# Altium schematic sheet Sheet.SchDoc
size A3
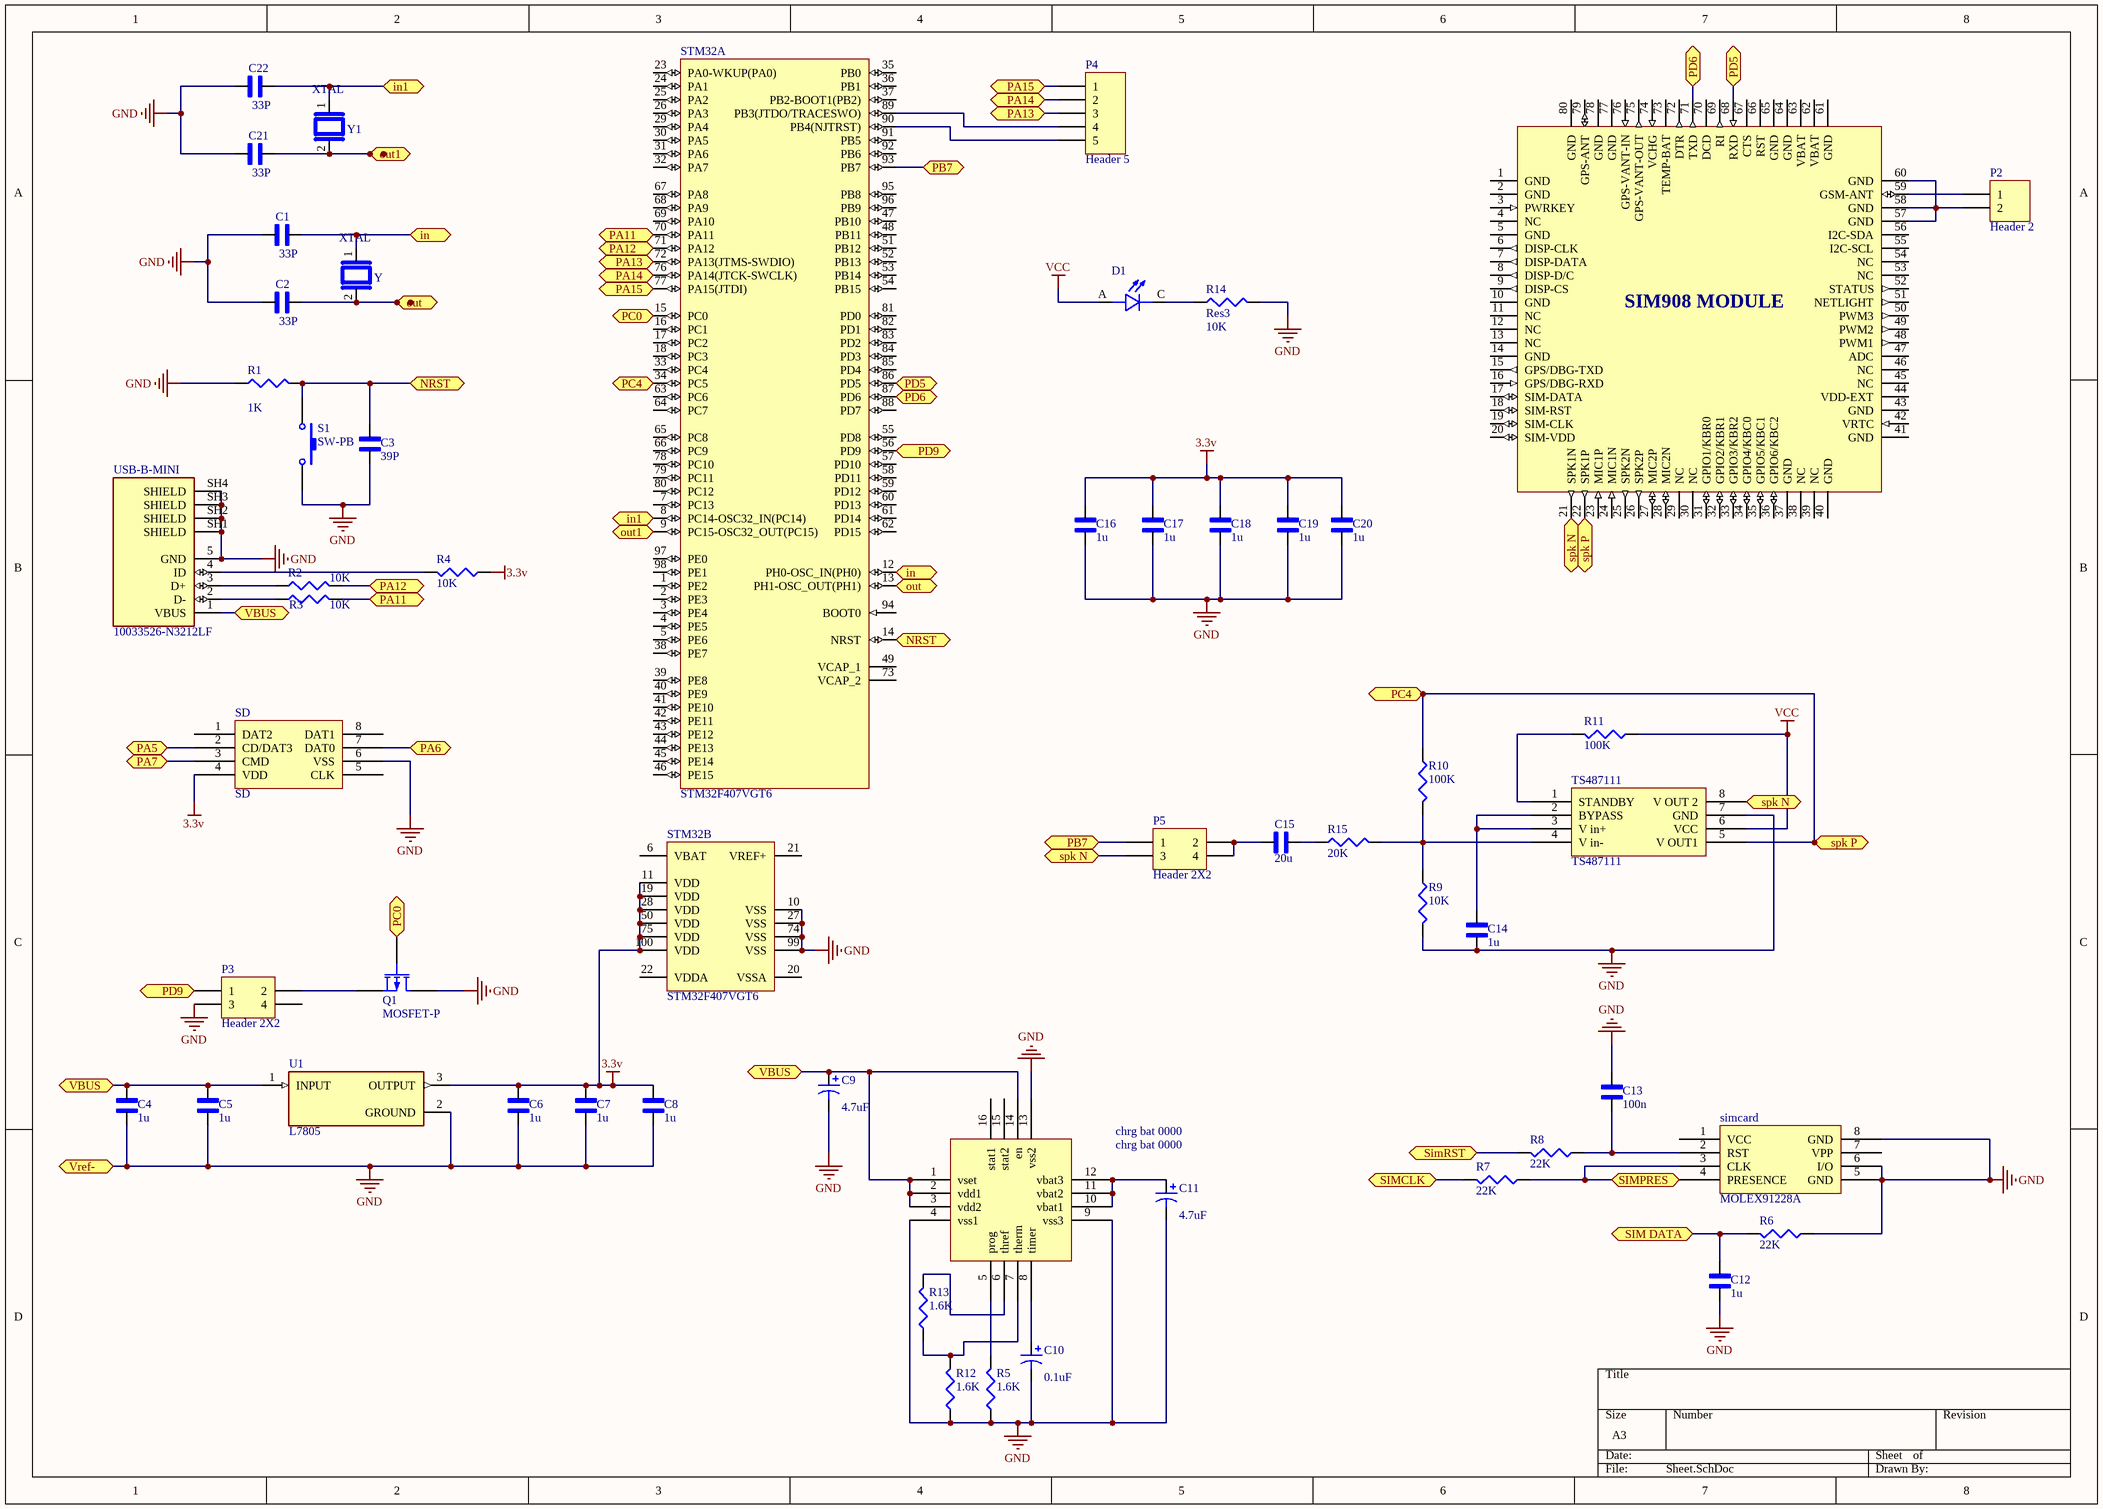
[diagram p0: Sheet.SchDoc]

## Parts
C1  value 33P  [CAP_CGJ3E3C0G2D101J080AA]  (hidden comment: CGJ3E3C0G2D101J080AA)
C2  value 33P  [CAP_CGJ3E3C0G2D101J080AA]  (hidden comment: CGJ3E3C0G2D101J080AA)
C3  value 39P  [CAP_CGJ3E3C0G2D101J080AA]  (hidden comment: CGJ3E3C0G2D101J080AA)
C4  value 1u  [CAP_CGJ3E3C0G2D101J080AA]  (hidden comment: CGJ3E3C0G2D101J080AA)
C5  value 1u  [CAP_CGJ3E3C0G2D101J080AA]  (hidden comment: CGJ3E3C0G2D101J080AA)
C6  value 1u  [CAP_CGJ3E3C0G2D101J080AA]  (hidden comment: CGJ3E3C0G2D101J080AA)
C7  value 1u  [CAP_CGJ3E3C0G2D101J080AA]  (hidden comment: CGJ3E3C0G2D101J080AA)
C8  value 1u  [CAP_CGJ3E3C0G2D101J080AA]  (hidden comment: CGJ3E3C0G2D101J080AA)
C9  value 4.7uF  [C0805]  (hidden comment: Cap Pol3)
C10  value 0.1uF  [C0805]  (hidden comment: Cap Pol3)
C11  value 4.7uF  [C0805]  (hidden comment: Cap Pol3)
C12  value 1u  [CAP_CGJ3E3C0G2D101J080AA]  (hidden comment: CGJ3E3C0G2D101J080AA)
C13  value 100n  [CAP_CGJ3E3C0G2D101J080AA]  (hidden comment: CGJ3E3C0G2D101J080AA)
C14  value 1u  [CAP_CGJ3E3C0G2D101J080AA]  (hidden comment: CGJ3E3C0G2D101J080AA)
C15  value 20u  [CAP_CGJ3E3C0G2D101J080AA]  (hidden comment: CGJ3E3C0G2D101J080AA)
C16  value 1u  [CAP_CGJ3E3C0G2D101J080AA]  (hidden comment: CGJ3E3C0G2D101J080AA)
C17  value 1u  [CAP_CGJ3E3C0G2D101J080AA]  (hidden comment: CGJ3E3C0G2D101J080AA)
C18  value 1u  [CAP_CGJ3E3C0G2D101J080AA]  (hidden comment: CGJ3E3C0G2D101J080AA)
C19  value 1u  [CAP_CGJ3E3C0G2D101J080AA]  (hidden comment: CGJ3E3C0G2D101J080AA)
C20  value 1u  [CAP_CGJ3E3C0G2D101J080AA]  (hidden comment: CGJ3E3C0G2D101J080AA)
C21  value 33P  [CAP_CGJ3E3C0G2D101J080AA]  (hidden comment: CGJ3E3C0G2D101J080AA)
C22  value 33P  [CAP_CGJ3E3C0G2D101J080AA]  (hidden comment: CGJ3E3C0G2D101J080AA)
chrg_bat_0000  chrg bat 0000  [chrg bat 0000]
D1  L08R5000Q1  [LEDRD254W57D500H1070]  (value not drawn)
P2  Header 2  [HDR1X2]
P3  Header 2X2  [HDR2X2]
P4  Header 5  [HDR1X5]
P5  Header 2X2  [HDR2X2]
Q1  MOSFET-P  [E3]
R1  value 1K  [J1-0603]  (hidden comment: Res3)
R2  value 10K  [J1-0603]  (hidden comment: Res3)
R3  value 10K  [J1-0603]  (hidden comment: Res3)
R4  value 10K  [J1-0603]  (hidden comment: Res3)
R5  value 1.6K  [J1-0603]  (hidden comment: Res3)
R6  value 22K  [J1-0603]  (hidden comment: Res3)
R7  value 22K  [J1-0603]  (hidden comment: Res3)
R8  value 22K  [J1-0603]  (hidden comment: Res3)
R9  value 10K  [J1-0603]  (hidden comment: Res3)
R10  value 100K  [J1-0603]  (hidden comment: Res3)
R11  value 100K  [J1-0603]  (hidden comment: Res3)
R12  value 1.6K  [J1-0603]  (hidden comment: Res3)
R13  value 1.6K  [J1-0603]  (hidden comment: Res3)
R14  Res3  value 10K  [J1-0603]
R15  value 20K  [J1-0603]  (hidden comment: Res3)
S1  SW-PB  [SPST-2]
SD  SD  [sd2]
SIM  SIM908  [Sim 908]  (value not drawn)
simcard  MOLEX91228A  [PCBComponent_1]
STM32  STM32F407VGT6  [STM-LQFP100_N]  (parts A,B of 2)
TS487111  TS487111  [TS4871B]
U1  L7805  [TO255P1020X450X2000-3]
USB-B-MINI  10033526-N3212LF  [AMPHENOL_10033526-N3212LF]
Y  XTAL  [XTAL_CM9V-T1A-32.768KHZ-7PF-20PPM-TA-QC]
Y1  XTAL  [XTAL_CM9V-T1A-32.768KHZ-7PF-20PPM-TA-QC]

## Ports
in, in1, NRST, out, out1, PA5, PA6, PA7, PA11, PA12, PA13, PA14, PA15, PB7, PC0, PC4, PD5, PD6, PD9, SIM DATA, SIMCLK, SIMPRES, SimRST, spk N, spk P, VBUS, Vref-

## Nets
3.3v: C6.2 C7.2 C8.2 C16.2 C17.2 C18.2 C19.2 C20.2 R4.1 SD.4(VDD) STM32.11(VDD) STM32.19(VDD) STM32.28(VDD) STM32.50(VDD) STM32.75(VDD) STM32.100(VDD) U1.3(OUTPUT)
GND: C1.1 C2.1 C3.1 C4.1 C5.1 C6.1 C7.1 C8.1 C9.2 C10.2 C11.2 C12.1 C13.2 C14.1 C16.1 C17.1 C18.1 C19.1 C20.1 C21.1 C22.1 chrg_bat_0000.4(vss1) chrg_bat_0000.9(vss3) chrg_bat_0000.13(vss2) P3.3 Q1.1(D) R1.1 R5.1 R6.1 R9.2 R12.1 R14.2 S1.2 SD.6(VSS) simcard.5(GND) simcard.6(I/O) simcard.8(GND) STM32.10(VSS) STM32.27(VSS) STM32.74(VSS) STM32.99(VSS) TS487111.7(GND) U1.2(GROUND) USB-B-MINI.5(GND) USB-B-MINI.SH1(SHIELD) USB-B-MINI.SH2(SHIELD) USB-B-MINI.SH3(SHIELD) USB-B-MINI.SH4(SHIELD) ; port Vref-
VCC: D1.A R11.1 TS487111.6(VCC)
in: C1.2 STM32.12(PH0-OSC_IN(PH0)) Y.1 ; port in
in1: C22.2 STM32.8(PC14-OSC32_IN(PC14)) Y1.1 ; port in1
NRST: C3.2 R1.2 S1.1 STM32.14(NRST) ; port NRST
out: C2.2 STM32.13(PH1-OSC_OUT(PH1)) Y.2 ; port out
out1: C21.2 STM32.9(PC15-OSC32_OUT(PC15)) Y1.2 ; port out1
PA5: SD.2(CD/DAT3) ; port PA5
PA6: SD.7(DAT0) ; port PA6
PA7: SD.3(CMD) ; port PA7
PA11: R3.2 STM32.70(PA11) ; port PA11
PA12: R2.2 STM32.71(PA12) ; port PA12
PA13: P4.3 STM32.72(PA13(JTMS-SWDIO)) ; port PA13
PA14: P4.2 STM32.76(PA14(JTCK-SWCLK)) ; port PA14
PA15: P4.1 STM32.77(PA15(JTDI)) ; port PA15
PB7: P5.1 STM32.93(PB7) ; port PB7
PC0: Q1.2(G) STM32.15(PC0) ; port PC0
PC4: R10.1 SIM.22(SPK1P) STM32.34(PC5) TS487111.5(V_OUT1) ; port PC4, port spk P
PD5: SIM.68(RXD) STM32.86(PD5) ; port PD5
PD6: SIM.71(TXD) STM32.87(PD6) ; port PD6
PD9: P3.1 STM32.56(PD9) ; port PD9
SIM DATA: C12.2 R6.2 ; port SIM DATA
SIMCLK: R7.2 ; port SIMCLK
SIMPRES: R7.1 simcard.3(CLK) simcard.4(PRESENCE) ; port SIMPRES
SimRST: R8.2 ; port SimRST
spk N: P5.3 SIM.21(SPK1N) TS487111.8(V_OUT_2) ; port spk N
VBUS: C4.2 C5.2 C9.1 chrg_bat_0000.1(vset) chrg_bat_0000.2(vdd1) chrg_bat_0000.3(vdd2) chrg_bat_0000.14(en) U1.1(INPUT) USB-B-MINI.1(VBUS) ; port VBUS
NetC10_1: C10.1 chrg_bat_0000.8(timer)
NetC11_1: C11.1 chrg_bat_0000.10(vbat1) chrg_bat_0000.11(vbat2) chrg_bat_0000.12(vbat3)
NetC13_1: C13.1 R8.1 simcard.2(RST)
NetC14_2: C14.2 TS487111.2(BYPASS) TS487111.3(V_in+)
NetC15_1: C15.1 R15.1
NetC15_2: C15.2 P5.2 P5.4
Netchrg_bat_0000_5: chrg_bat_0000.5(prog) R5.2
Netchrg_bat_0000_6: chrg_bat_0000.6(thref) R13.2
Netchrg_bat_0000_7: chrg_bat_0000.7(therm) R12.2 R13.1
NetD1_C: D1.C R14.1
NetP2_1: P2.1 SIM.59(GSM-ANT)
NetP2_2: P2.2 SIM.57(GND) SIM.58(GND) SIM.60(GND)
NetP3_2: P3.2 Q1.3(S)
NetP4_4: P4.4 STM32.89(PB3(JTDO/TRACESWO))
NetP4_5: P4.5 STM32.90(PB4(NJTRST))
NetR2_1: R2.1 USB-B-MINI.3(D+)
NetR3_1: R3.1 USB-B-MINI.2(D-)
NetR4_2: R4.2 USB-B-MINI.4(ID)
NetR9_1: R9.1 R10.2 R15.2 TS487111.4(V_in-)
NetR11_2: R11.2 TS487111.1(STANDBY)

Not connected (* = marked no-connect by the designer): chrg_bat_0000 15(stat2) 16(stat1); P3 4; SD 1(DAT2) 5(CLK) 8(DAT1); SIM 1(GND) 2(GND) 3(PWRKEY) 4(NC) 5(GND) 6(DISP-CLK) 7(DISP-DATA) 8(DISP-D/C) 9(DISP-CS) 10(GND) 11(NC) 12(NC) 13(NC) 14(GND) 15(GPS/DBG-TXD) 16(GPS/DBG-RXD) 17(SIM-DATA) 18(SIM-RST) 19(SIM-CLK) 20(SIM-VDD) 23(MIC1P) 24(MIC1N) 25(SPK2N) 26(SPK2P) 27(MIC2P) 28(MIC2N) 29(NC) 30(NC) 31(GPIO1/KBR0) 32(GPIO2/KBR1) 33(GPIO3/KBR2) 34(GPIO4/KBC0) 35(GPIO5/KBC1) 36(GPIO6/KBC2) 37(GND) 38(NC) 39(NC) 40(GND) 41(GND) 42(VRTC) 43(GND) 44(VDD-EXT) 45(NC) 46(NC) 47(ADC) 48(PWM1) 49(PWM2) 50(PWM3) 51(NETLIGHT) 52(STATUS) 53(NC) 54(NC) 55(I2C-SCL) 56(I2C-SDA) 61(GND) 62(VBAT) 63(VBAT) 64(GND) 65(GND) 66(RST) 67(CTS) 69(RI) 70(DCD) 72(DTR) 73(TEMP-BAT) 74(VCHG) 75(GPS-VANT-OUT) 76(GPS-VANT-IN) 77(GND) 78(GND) 79(GPS-ANT) 80(GND); simcard 1(VCC) 7(VPP); STM32 1(PE2) 2(PE3) 3(PE4) 4(PE5) 5(PE6) 6(VBAT) 7(PC13) 16(PC1) 17(PC2) 18(PC3) 20(VSSA) 21(VREF+) 22(VDDA) 23(PA0-WKUP(PA0)) 24(PA1) 25(PA2) 26(PA3) 29(PA4) 30(PA5) 31(PA6) 32(PA7) 33(PC4) 35(PB0) 36(PB1) 37(PB2-BOOT1(PB2)) 38(PE7) 39(PE8) 40(PE9) 41(PE10) 42(PE11) 43(PE12) 44(PE13) 45(PE14) 46(PE15) 47(PB10) 48(PB11) 49(VCAP_1) 51(PB12) 52(PB13) 53(PB14) 54(PB15) 55(PD8) 57(PD10) 58(PD11) 59(PD12) 60(PD13) 61(PD14) 62(PD15) 63(PC6) 64(PC7) 65(PC8) 66(PC9) 67(PA8) 68(PA9) 69(PA10) 73(VCAP_2) 78(PC10) 79(PC11) 80(PC12) 81(PD0) 82(PD1) 83(PD2) 84(PD3) 85(PD4) 88(PD7) 91(PB5) 92(PB6) 94(BOOT0) 95(PB8) 96(PB9) 97(PE0) 98(PE1)

## Notes on the sheet
- (in symbol SIM908) SIM908 MODULE

## Library data of the parts
C1-C8 C12-C22 = CGJ3E3C0G2D101J080AA: High Reliability - Autograde Plus+ / 7 (180mm); MF: TDK; Price: None; SnapEDA_Link: https://www.snapeda.com/parts/CGJ3E3C0G2D101J080AA/TDK/view-part/?ref=snap; MP: CGJ3E3C0G2D101J080AA; Purchase-URL: https://pricing.snapeda.com/search/part/CGJ3E3C0G2D101J080AA/?ref=eda; Availability: In Stock; Package: 1608-2 TDK; Check_prices: https://www.snapeda.com/parts/CGJ3E3C0G2D101J080AA/TDK/view-part/?ref=eda
C9-C11 = Cap Pol3: Polarized Capacitor (Surface Mount); Published: 8-Jun-2000; LatestRevisionDate: 29-May-2009; LatestRevisionNote: IPC-7351 Footprint Added.; PackageReference: C0805; Publisher: Altium Limited; PackageDescription: Chip Capacitor
chrg_bat_0000 SD simcard TS487111 = Component_1
D1 = L08R5000Q1: LED, 5MM, ORANGE; LED / Lamp Size: 5mm / T-1 3/4; LED Colour: Orange; Typ Luminous Intensity: 4.3mcd; Viewing Angle: ...; MF: LED Technology; Value: *; SnapEDA_Link: https://www.snapeda.com/parts/L08R5000Q1/LED+Technology/view-part/?ref=snap; MP: L08R5000Q1; Check_prices: https://www.snapeda.com/parts/L08R5000Q1/LED+Technology/view-part/?ref=eda; Availability: In Stock; Price: None; Package: None
P2 = Header 2: Header, 2-Pin; LatestRevisionDate: 17-Jul-2002; LatestRevisionNote: Re-released for DXP Platform.; Publisher: Altium Limited
P3 P5 = Header 2X2: Header, 2-Pin, Dual row; LatestRevisionDate: 17-Jul-2002; LatestRevisionNote: Re-released for DXP Platform.; Publisher: Altium Limited
P4 = Header 5: Header, 5-Pin; LatestRevisionDate: 17-Jul-2002; LatestRevisionNote: Re-released for DXP Platform.; Publisher: Altium Limited
Q1 = MOSFET-P: P-Channel MOSFET; Published: 8-Jun-2000; LatestRevisionDate: 17-Jul-2002; LatestRevisionNote: Re-released for DXP Platform.; PackageVersion: 1995/1996; PackageReference: E3; Publisher: Altium Limited; PackageDescription: TO, Flat Index; 3 In-Line, Axial Leads; Body Dia. 4.6mm; Lead Dia. 0.5 mm (max)
R1-R15 = Res3: Resistor; Published: 8-Jun-2000; LatestRevisionDate: 29-May-2009; LatestRevisionNote: IPC-7351 Footprint Added.; PackageReference: J1-0603; Publisher: Altium Limited; PackageDescription: Chip Resistor
S1 = SW-PB: Switch; Published: 24-Mar-1999; LatestRevisionDate: 17-Jul-2002; LatestRevisionNote: Re-released for DXP Platform.; PackageReference: SPST-2; Publisher: Altium Limited; PackageDescription: Switch; 2 Leads
STM32 = STM32F407VGT6: ARM Cortex-M4 32-bit MCU+FPU, 210 DMIPS, 1024 kB Flash, 192 kB Internal RAM, 82 I/Os, 100-pin LQFP, -40 to 85 degC, Tray; Manufacturer: STMicroelectronics; D/A Converter: 2x12-bit; FLASH Size (Prog) (kB): 1024; I/Os (High Current): 82; Internal RAM Size (kB): 192; Operating Frequency(F) (Processor speed) (MHz): 168; Supply Voltage(Vcc) max (V): 3.6; Supply Voltage(Vcc) min (V): 1.8; DatasheetVersion: Rev. 4; PackageVersion: Rev. 1, 06/2013; PackageReference: LQFP100; PackageDescription: 100-Pin Low Profile Quad Flat Package, 14 x 14 mm Body, 0.5 mm Pitch; Supplier 1: Digi-Key; Supplier Part Number 1: 497-11605-ND; Supplier 2: Farnell; Supplier Part Number 2: 2064368; Supplier 3: Newark; Supplier Part Number 3: 73T2333; Supplier 4: Mouser; Supplier Part Number 4: 511-STM32F407VGT6; Core: ARM Cortex-M4; Packing: Tray; Mounting Technology: Surface Mount; PartNumber: STM32F407VGT6; ComponentLink1Description: Manufacturer URL; ComponentLink1URL: http://www.st.com/web/en/home.html; ComponentLink2Description: Datasheet; ComponentLink2URL: http://www.st.com/st-web-ui/static/active/en/resource/technical/document/datasheet/DM00037051.pdf; ComponentLink3Description: Package Specification; ComponentLink3URL: http://www.st.com/st-web-ui/static/active/en/resource/technical/document/data_brief/DM00071938.pdf
U1 = L7805: Standard Regulator Pos 5V 1.5A 3-Pin(3+Tab) TO-220FP Tube; MF: STMicroelectronics; MP: L7805; Value: *; SnapEDA_Link: https://www.snapeda.com/parts/L7805/STMicroelectronics/view-part/?ref=snap; Price: None; Package: None; Check_prices: https://www.snapeda.com/parts/L7805/STMicroelectronics/view-part/?ref=eda; Availability: Not in stock
USB-B-MINI = 10033526-N3212LF: Conn Mini USB Type B RCP 5 POS 0.8mm Solder RA SMD 5 Terminal 1 Port T/R; MF: Amphenol; SnapEDA_Link: https://www.snapeda.com/parts/10033526-N3212LF/Amphenol/view-part/?ref=snap; Package: None; Value: *; MP: 10033526-N3212LF; Check_prices: https://www.snapeda.com/parts/10033526-N3212LF/Amphenol/view-part/?ref=eda
Y = CM9V-T1A-32.768KHZ-7PF-20PPM-TA-QC: Tuning Fork Crystal 32.768kHz in 1.0x 1.6mm package; Value: 8 MHZ; MF: Micro Crystal; SnapEDA_Link: https://www.snapeda.com/parts/CM9V-T1A-32.768KHZ-7PF-20PPM-TA-QC/Micro+Crystal/view-part/?ref=snap; Package: SMD-2 Micro Crystal; MP: CM9V-T1A-32.768KHZ-7PF-20PPM-TA-QC; Check_prices: https://www.snapeda.com/parts/CM9V-T1A-32.768KHZ-7PF-20PPM-TA-QC/Micro+Crystal/view-part/?ref=eda
Y1 = CM9V-T1A-32.768KHZ-7PF-20PPM-TA-QC: Tuning Fork Crystal 32.768kHz in 1.0x 1.6mm package; Value: 32KHZ; MF: Micro Crystal; SnapEDA_Link: https://www.snapeda.com/parts/CM9V-T1A-32.768KHZ-7PF-20PPM-TA-QC/Micro+Crystal/view-part/?ref=snap; Package: SMD-2 Micro Crystal; MP: CM9V-T1A-32.768KHZ-7PF-20PPM-TA-QC; Check_prices: https://www.snapeda.com/parts/CM9V-T1A-32.768KHZ-7PF-20PPM-TA-QC/Micro+Crystal/view-part/?ref=eda